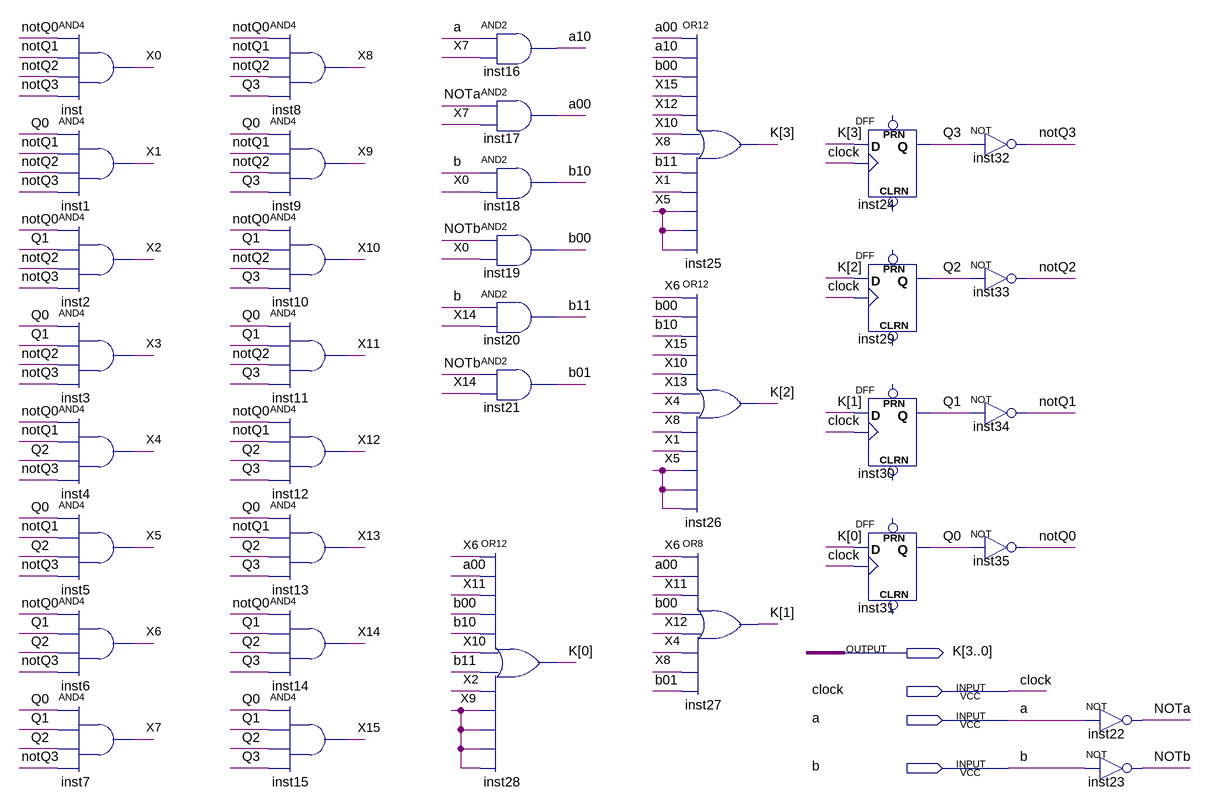
[diagram p0: schematic sheet]
// Quartus schematic cnt.bdf as structural Verilog: 36 symbols, 4 pins
module cnt (
  input  clock,
  input  a,
  input  b,
  output [3:0] K
);

  wire a00, a10, b00, b01, b10, b11, NOTa, NOTb, notQ0, notQ1, notQ2, notQ3, Q0, Q1, Q2, Q3, X0, X1, X2, X3,
       X4, X5, X6, X7, X8, X9, X10, X11, X12, X13, X14, X15;

  and inst (X0, notQ0, notQ1, notQ2, notQ3);
  and inst1 (X1, Q0, notQ1, notQ2, notQ3);
  and inst2 (X2, notQ0, Q1, notQ2, notQ3);
  and inst3 (X3, Q0, Q1, notQ2, notQ3);
  and inst4 (X4, notQ0, notQ1, Q2, notQ3);
  and inst5 (X5, Q0, notQ1, Q2, notQ3);
  and inst6 (X6, notQ0, Q1, Q2, notQ3);
  and inst7 (X7, Q0, Q1, Q2, notQ3);
  and inst8 (X8, notQ0, notQ1, notQ2, Q3);
  and inst9 (X9, Q0, notQ1, notQ2, Q3);
  and inst10 (X10, notQ0, Q1, notQ2, Q3);
  and inst11 (X11, Q0, Q1, notQ2, Q3);
  and inst12 (X12, notQ0, notQ1, Q2, Q3);
  and inst13 (X13, Q0, notQ1, Q2, Q3);
  and inst14 (X14, notQ0, Q1, Q2, Q3);
  and inst15 (X15, Q0, Q1, Q2, Q3);
  and inst16 (a10, a, X7);
  and inst17 (a00, NOTa, X7);
  and inst18 (b10, b, X0);
  and inst19 (b00, NOTb, X0);
  and inst20 (b11, b, X14);
  and inst21 (b01, NOTb, X14);
  or inst28 (K[0], X6, a00, X11, b00, b10, X10, b11, X2, X9, X9, X9, X9);
  or inst25 (K[3], a00, a10, b00, X15, X12, X10, X8, b11, X1, X5, X5, X5);
  or inst26 (K[2], X6, b00, b10, X15, X10, X13, X4, X8, X1, X5, X5, X5);
  or inst27 (K[1], X6, a00, X11, b00, X12, X4, X8, b01);
  DFF inst24 (.CLK(clock), .D(K[3]), .Q(Q3));  // open: CLRN, PRN
  DFF inst29 (.CLK(clock), .D(K[2]), .Q(Q2));  // open: CLRN, PRN
  DFF inst30 (.CLK(clock), .D(K[1]), .Q(Q1));  // open: CLRN, PRN
  DFF inst31 (.CLK(clock), .D(K[0]), .Q(Q0));  // open: CLRN, PRN
  not inst32 (notQ3, Q3);
  not inst33 (notQ2, Q2);
  not inst34 (notQ1, Q1);
  not inst35 (notQ0, Q0);
  not inst22 (NOTa, a);
  not inst23 (NOTb, b);
endmodule
